# EAGLE design Adafruit Verter TPS63060 2A BoostBuck (EAGLE 6.3)
COMPANY: ADAFRUIT INDUSTRIES; DRAWN: KTOWN; REV: A
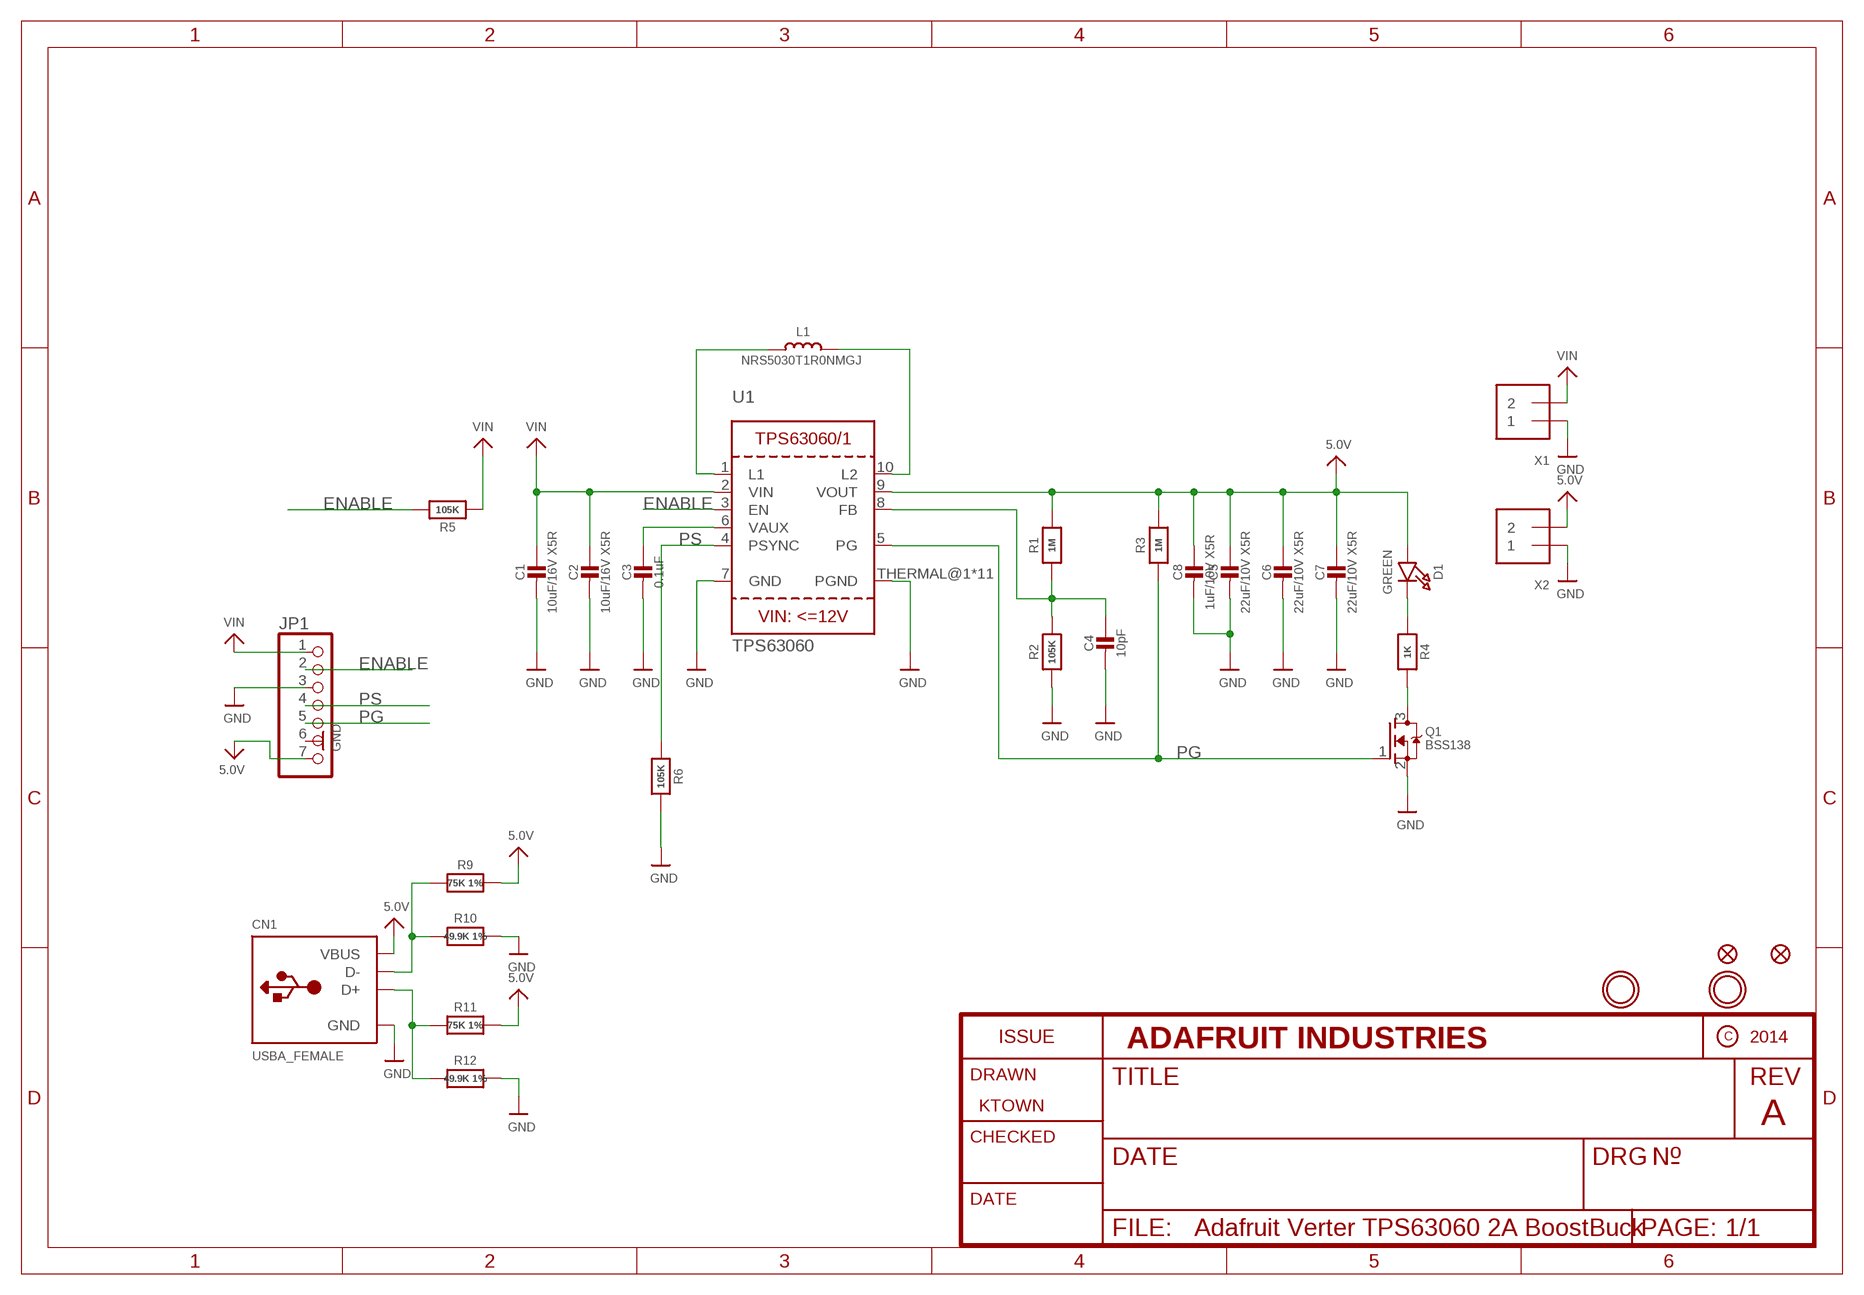
[diagram p0: schematic, sheet 1]

## Parts
C1  10uF/16V X5R  CAP_CERAMIC0805-NOOUTLINE  [0805-NO]
C2  10uF/16V X5R  CAP_CERAMIC0805-NOOUTLINE  [0805-NO]
C3  0.1uF  CAP_CERAMIC0805-NOOUTLINE  [0805-NO]
C4  10pF  CAP_CERAMIC0805-NOOUTLINE  [0805-NO]
C5  22uF/10V X5R  CAP_CERAMIC0805-NOOUTLINE  [0805-NO]
C6  22uF/10V X5R  CAP_CERAMIC0805-NOOUTLINE  [0805-NO]
C7  22uF/10V X5R  CAP_CERAMIC0805-NOOUTLINE  [0805-NO]
C8  1uF/10V X5R  CAP_CERAMIC0805-NOOUTLINE  [0805-NO]
CN1  USBA_FEMALE  USB_TYPEAPTHFML  [USB_HOST-PTH]
D1  GREEN  LED0805_NOOUTLINE  [CHIPLED_0805_NOOUTLINE]
FID1  FIDUCIAL""  [FIDUCIAL_1MM]
FID2  FIDUCIAL""  [FIDUCIAL_1MM]
JP1  HEADER-1X770MIL  [1X07_ROUND_70]
L1  NRS5030T1R0NMGJ  INDUCTORTDK_VLC5045  [INDUCTOR_5X5MM_TDK_VLC5045]
Q1  BSS138  MOSFET-NWIDE  [SOT23-WIDE]
R1  1M  RESISTOR0805_NOOUTLINE  [0805-NO]
R2  105K  RESISTOR0805_NOOUTLINE  [0805-NO]
R3  1M  RESISTOR0805_NOOUTLINE  [0805-NO]
R4  1K  RESISTOR0805_NOOUTLINE  [0805-NO]
R5  105K  RESISTOR0805_NOOUTLINE  [0805-NO]
R6  105K  RESISTOR0805_NOOUTLINE  [0805-NO]
R9  75K 1%  RESISTOR0805_NOOUTLINE  [0805-NO]
R10  49.9K 1%  RESISTOR0805_NOOUTLINE  [0805-NO]
R11  75K 1%  RESISTOR0805_NOOUTLINE  [0805-NO]
R12  49.9K 1%  RESISTOR0805_NOOUTLINE  [0805-NO]
U1  TPS63060  VREG_TPS63060/1  [PWSON-N10]
U$15  MOUNTINGHOLE2.5  [MOUNTINGHOLE_2.5_PLATED]
U$17  MOUNTINGHOLE2.5  [MOUNTINGHOLE_2.5_PLATED]
X1  TERMBLOCK_1X2  [TERMBLOCK_1X2-3.5MM]
X2  TERMBLOCK_1X2  [TERMBLOCK_1X2-3.5MM]

## Nets
5.0V: C5.1 C6.1 C7.1 C8.1 CN1.VBUS D1.A JP1.7 R1.2 R3.2 R9.2 R11.2 U1.9(VOUT) X2.2
D+: CN1.D+ R11.1 R12.1
D-: CN1.D- R9.1 R10.1
ENABLE: JP1.2 R5.2 U1.3(EN)
GND: C1.2 C2.2 C3.2 C4.2 C5.2 C6.2 C7.2 C8.2 CN1.GND JP1.3 JP1.6 Q1.2(S) R2.1 R6.2 R10.2 R12.2 U1.7(GND) U1.THERMAL@1(PGND) U1.THERMAL@5(PGND) U1.THERMAL@6(PGND) U1.THERMAL@7(PGND) U1.THERMAL@8(PGND) U1.THERMAL@9(PGND) U1.THERMAL@10(PGND) U1.THERMAL@11(PGND) U1.THERMAL@12(PGND) U1.THERMAL@13(PGND) U1.THERMAL@14(PGND) X1.1 X2.1
N$1: L1.P$1 U1.1(L1)
N$2: L1.P$2 U1.10(L2)
N$3: C3.1 U1.6(VAUX)
N$4: D1.C R4.1
N$5: C4.1 R1.1 R2.2 U1.8(FB)
N$6: Q1.3(D) R4.2
PG: JP1.5 Q1.1(G) R3.1 U1.5(PG)
PS: JP1.4 R6.1 U1.4(PSYNC)
VIN: C1.1 C2.1 JP1.1 R5.1 U1.2(VIN) X1.2

## Library data of the parts
C1-C8 = microbuilder:CAP_CERAMIC: Ceramic Capacitors For new designs, use the packages preceded by an '_' character since they are more reliable: The following footprints should be used on most boards: _0402 - Standard footprint for regular board layouts _0603 - Standard footprint for regular board layouts _0805 - Standard footprint for regular board layouts _1206 - Standard footprint for regular board layouts For extremely tight-pitch boards where space is at a premium, the following 'micro-pitch' footprints can be used (smaller pads, no silkscreen outline, etc.): _0402MP - Micro-pitch footprint for very dense/compact boards _0603MP - Micro-pitch footprint for very dense/compact boards _0805MP - Micro-pitch footprint for very dense/compact boards _1206MP - Micro-pitch footprint for very dense/compact boards
CN1 = microbuilder:USB_TYPEA: USB - Type A Connectors Male types stick out and are inserted into a PC or matching females parts (these are the connectors used on USB Memory Sticks, etc.). Female parts are generally used for USB Host and accept a male-type connector. SMT - 4UCON: 10017 PTHFML - Digikey: 609-1045-ND, 4UCon: 05241 PCB - Use 2.0mm thick PCBs with this footprint
D1 = microbuilder:LED: LED 0603 - 0603 Surface Mount Package 2mA: Green LED - Low Power (3.9mcd, 2ma, 1.7Vf) - Digikey: 475-2709-2-ND Orange LED - Low Power (9.8mcd, 2ma, 1.8Vf) - Digikey: 475-1194-2-ND Red LED - Low Power (5mcd, 2ma, 1.8Vf) - Digikey: 475-1195-2-ND Yellow LED - Low Power (7mcd, 2ma, 1.8Vf) - Digikey: 475-1196-2-ND 5mA: Blue LED - Low Power (17mcd, 5ma, 2.9Vf) - Digikey: LNJ937W8CRACT-ND 0805 - 0805 Surface Mount Package 2mA: Red LED (8.8mcd, 2mA, 1.8Vf, Clear) - Low Power [Digikey: 475-2510-1-ND] Green LED (5mcd, 2mA, 1.8Vf, Clear) - Low Power [Digikey: 475-2730-1-ND] Yellow LED (11.3mcd, 2mA, 1.8Vf, Clear) - Low Power [Digikey: 475-2555-1-ND] 20mA: Red LED (104mcd, 20mA, Diffused) - LS R976 [Digikey: 475-1278-6-ND] Red LED (12mcd, 20mA, 2.0Vf, Clear) - APT2012EC [Digikey: 754-1128-1-ND] Green LED (15mcd, 20mA, 2.2Vf, Clear) - APT2012GC [Digikey: 754-1131-1-ND] Orange LED (160mcd, 20mA, 2.1Vf, Clear) - APT2012SECK [Digikey: 754-1130-1-ND] 1206 - 1206 Surface Mount Package Green LED (26mcd, 20mA, Diffused) - LG N971 [Digikey: 475-1407-6-ND] Red LED (15mcd, 20mA, Diffused) - LH N974 [Digikey: 475-1416-6-ND] Cree - Cree High-Power Surface Mount LEDs XPEBWT-L1-0000-00D50 - White 111lm 350mA 2.9Vf 6200K 110° XTEAWT-00-0000-00000LEE3 - White 114lm 350mA 2.85Vf 5000K 115° Everlight - Everlight 45-21 Series Surface Mount LEDs 45-21/QK2C-B2832AC2CB2/2T - Warm White 2000mcd 20mA 3.25Vf 3050K 120° 45-21/LK2C-B38452C4CB2/2T - Nuetral White 2000mcd 20mA 3.25Vf 4150K 120° 45-21/LK2C-B50634C6CB2/2T - Cold White 2200mcd 20mA 3.25Vf 5650K 120° PLCC2 Reverse Mount LS T77K-J1L2-1-0-2-R18-Z - Red 11.25mcd 2mA 1.8Vf 630nm 120° LO T77K-L1M2-24-Z - Orange 19.6mcd 2mA 1.8Vf 606nm 120° LY T77K-K2M1-26-Z - Yellow 15.7mcd 2mA 1.8Vf 587nm 120°
FID1 FID2 = microbuilder:FIDUCIAL: Fiducial Alignment Points Various fiducial points for machine vision alignment.; BOM: EXCLUDE
JP1 = microbuilder:HEADER-1X7: PIN HEADER
L1 = microbuilder:INDUCTOR: Inductors 0603: 10nH Ceramic Inductor - microwire antenna/RF (Digikey: 712-1434-2-ND) 0805: 560nH Ceramic Inductor - RF (Digikey: 553-1047-1-ND) 270nH Ceramic Inductor - Q = 40@250MHz, +-5%, 1 Ohm DC Resistance (Digikey: 535-10506-2-ND) 1007 (2518 Metric) SMT: 10µH 10% 250mOhm 820mA 1007 Inductor (Digikey: 587-2189-1-ND) 22µH 10% 500mOhm 580mA 1007 Inductor (Digikey: 587-2190-1-ND) 47µH 10% 950mOhm 420mA 1007 Inductor (Digikey: 587-2191-1-ND) 47µH 5% 100mOhm 1A 1008 Inductor (Digikey: 732-1816-1-ND) 5.0x5.0mm (Taiyo Yuden NR5040 Series) 6.8µH 20% 2.3A 64mOhm Inductor (Digikey: 587-2374-2-ND) 5.0x5.0mm (TDK VLC5045 Series) 4.7µH 20% 3.3A 34mOhm Inductor (Digikey: 445-6526-1-ND) 6.8µH 20% 2.7A 46mOhm Inductor (Digikey: 445-6527-1-ND) 6.0x6.0mm (TDK VLC6045 Series) 4.7µH 20% 3.8A 27mOhm Inductor (Digikey: 445-6538-2-ND) 6.8µH 20% 3A 41mOhm Inductor (Digikey: 445-6540-1-ND) 6.2µH 30% 2.2A 45mOhm Inductor (Digikey: SRR5028-6R2YCT-ND) - Not TDK VLC6045 but footprint should match 6.0x6.0mm (TDK SLF6045 Series) 6.8uH 30% 2A 33mOhm Inductor (Digikey: 445-4572-1-ND, Mouser: 810-SLF645T6R8N2R0PF) 6.0x6.0mm (Sumida CDRH5D28 Series) 6.2uH 30% 1.8A 45mOhm Inductor (Digikey: 308-1542-1-ND) Taiyo Yuden NR3015T2R2M - 2.2uH 20% 1.5A (Digikey: 587-1648-2-ND, Mouser: 963-NR3015T2R2M) - Used with TI TPS62172 CoilCraft RFID Transponder Coil - MA5532-AE (For use with AS3935 Lightning Sensor) Vishay IHLP 1.0uH Molded Inductor - 24mOhm DCR, 5A, +/-20%, -55°C-125°C (Digikey: 541-1319-1-ND)
Q1 = microbuilder:MOSFET-N: N-Channel Mosfet LEGEND VDS: Voltage Drain-Source ID: Drain Current RDS(ON): Drain-Source On-State Resistance VGS(TH): Gate-Source Threshold Voltage CISS: Drain-Source Input Capacitance SOT-23 Name VDS ID RDS(ON) VGS(TH) CISS Order Number 2N7002E 60V 260mA 2.5 Ohm 2.5V @ 250uA 26.7pF @ 25V 2N7002ET1GOSTR-ND BSH103 30V 850mA 400 mOhm 400mV @ 1mA 83pF @ 24V BSH103,235-ND BSS138 60V 320mA 1.6 Ohm 1.5V @ 250uA 50pF @ 10V Mouser: 771-BSS138PW115 DMN2075U-7 20V 4.2A 38 mOhm 1V @ 250 uA 594.3pF @ 10V DMN2075U-7DICT-ND * BSS138 good choice for I2C level-shifting POWERPAK 1212-8 Name VDS ID RDS(ON) VGS(TH) CISS Order Number Si7308DN 60V 6A 58 mOhm 3V @ 250uA 665pF @ 15V SI7308DN-T1-E3CT-ND
R1-R6 R9-R12 = microbuilder:RESISTOR: Resistors For new designs, use the packages preceded by an '_' character since they are more reliable: The following footprints should be used on most boards: _0402 - Standard footprint for regular board layouts _0603 - Standard footprint for regular board layouts _0805 - Standard footprint for regular board layouts _1206 - Standard footprint for regular board layouts For extremely tight-pitch boards where space is at a premium, the following 'micro-pitch' footprints can be used (smaller pads, no silkscreen outline, etc.): _0402MP - Micro-pitch footprint for very dense/compact boards _0603MP - Micro-pitch footprint for very dense/compact boards _0805MP - Micro-pitch footprint for very dense/compact boards _1206MP - Micro-pitch footprint for very dense/compact boards
U1 = microbuilder:VREG_TPS63060/1: TPS63060/63061 2A Boost/Buck Switch Converter VIN: 2.5 - 12V Fixed frequency operation: 2.4MHz
U$15 U$17 = microbuilder:MOUNTINGHOLE: Mounting Hole For #2 screws (0.086"/2.18mm width, 0.094"/2.4mm hole) use 2.5mm; BOM: EXCLUDE
X1 X2 = microbuilder:TERMBLOCK_1X2: 3.5mm Terminal block http://www.ladyada.net/library/pcb/eaglelibrary.html

## Board
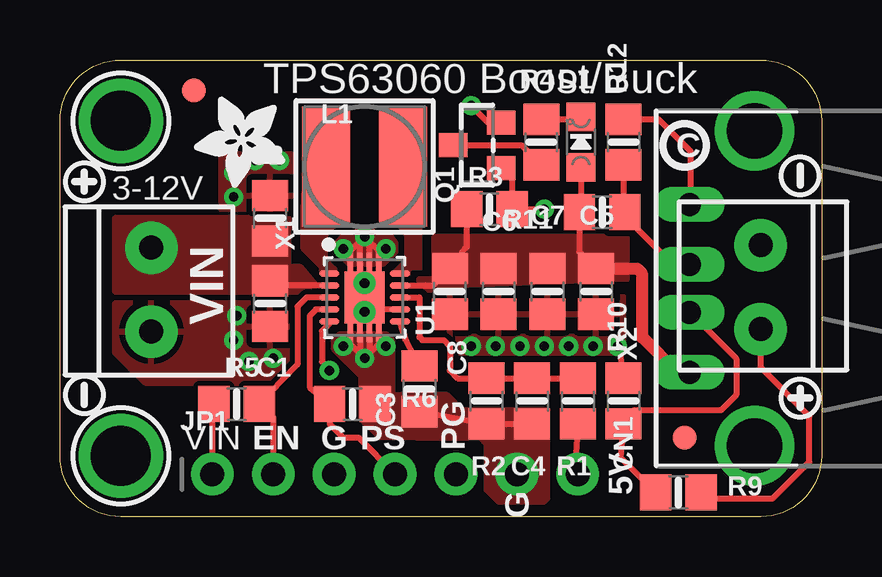
[diagram p1: board, top side]
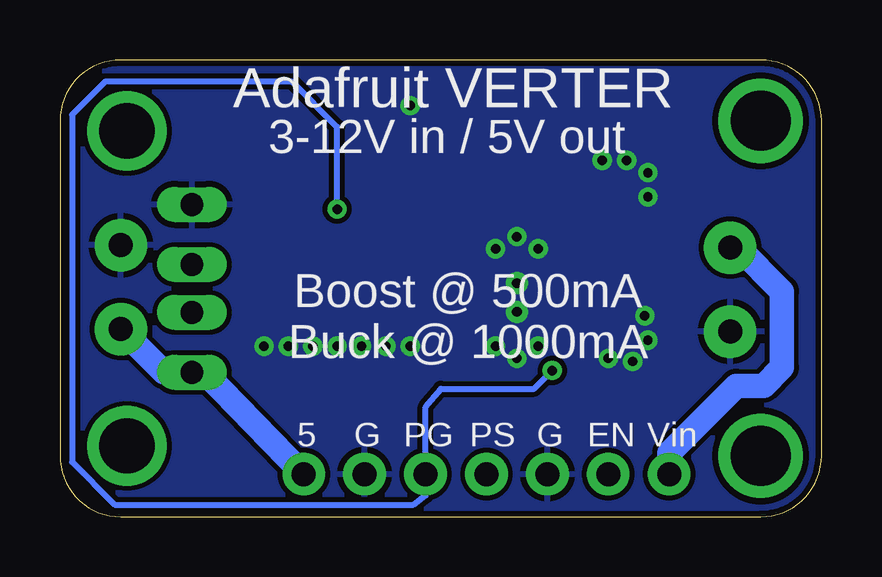
[diagram p2: board, bottom side, seen from below]

Size 31.75 x 19.05 mm. Coordinates in mm from the lower left corner, seen from the top.
Outline: 31.75,16.51 31.75,2.54 arc-90 29.21,0 2.54,0 arc-90 0,2.54 0,16.51 arc-90 2.54,19.05 29.21,19.05 arc-90 31.75,16.51
Copper layers (1*16): Top 0.035mm / dielectric 1.5mm / Bottom 0.035mm
Design rules "adafruit": minimum track width 8mil, minimum drill 15.5mil, track to track 8mil, track to pad 8mil, pad to pad 8mil, via to via 8mil, smd to smd 8mil, copper to edge 10mil, drill to drill 8mil, minimum pad ring 10mil, minimum via ring 8mil, stop-mask expansion 2mil, vias tented up to drill 20mil, thermal gap 10mil

### Footprints (pad centres in the part's own frame; a part is rotated, then mirrored left to right if it is on the bottom)
0805-NO = smd 1.3 x 1.5: 1 -0.95,0; 2 0.95,0
USB_HOST-PTH = drill 0.95 long: D+ 1,6.52; D- -1,6.52; GND 3.5,6.52; VBUS -3.5,6.52 | drill 2.3 pad 2.9: S1 -6.57,3.81; S2 6.57,3.81
CHIPLED_0805_NOOUTLINE = smd 1.2 x 1.2: A 0,-1.05; C 0,1.05
FIDUCIAL_1MM = smd 1 x 1: 1 0,0
1X07_ROUND_70 = drill 1 pad 1.778: 1 -7.62,0; 2 -5.08,0; 3 -2.54,0; 4 0,0; 5 2.54,0; 6 5.08,0; 7 7.62,0
INDUCTOR_5X5MM_TDK_VLC5045 = smd 2 x 5: P$1 -1.6,0; P$2 1.6,0
SOT23-WIDE = smd 1 x 1.2: 1 -0.95,-1; 2 0.95,-1; 3 0,1
PWSON-N10 = smd 0.28 x 0.85: 1 -1,-1.475; 2 -0.5,-1.475; 3 0,-1.475; 4 0.5,-1.475; 5 1,-1.475; 6 1,1.475; 7 0.5,1.475; 8 0,1.475; 9 -0.5,1.475; 10 -1,1.475 | smd 2.15 x 1.66: THERMAL@1 0,0 | drill 0.4 pad 0.6: THERMAL@5 -0.6,0; THERMAL@6 0.6,0 | smd 0.8 x 0.23: THERMAL@7 1.46,0.6; THERMAL@8 1.46,0.2; THERMAL@9 1.46,-0.2; THERMAL@10 1.46,-0.6; THERMAL@11 -1.46,-0.6; THERMAL@12 -1.46,-0.2; THERMAL@13 -1.46,0.2; THERMAL@14 -1.46,0.6
MOUNTINGHOLE_2.5_PLATED = drill 2.5 pad 3.2: P$1 0,0
TERMBLOCK_1X2-3.5MM = drill 1 pad 2.184: 1 1.8,0; 2 -1.7,0

### Placement (x,y rotation side)
C1  8.76,8.89 270 top
C2  8.76,12.45 90 top
C3  14.99,5.33 270 top
C4  19.68,4.83 270 top
C5  22.35,9.4 270 top
C6  18.29,9.4 270 top
C7  20.32,9.4 270 top
C8  16.26,9.4 270 top
CN1  32.77,9.53 90 top
D1  21.72,15.62 0 top
FID1  26.04,3.3 0 top
FID2  5.59,17.78 0 top
JP1  13.97,1.78 0 top
L1  12.7,14.61 0 top
Q1  17.4,15.49 90 top
R1  21.59,4.83 270 top
R2  17.78,4.83 90 top
R3  17.91,12.83 180 top
R4  20.07,15.62 270 top
R5  7.37,4.7 0 top
R6  12.19,4.7 0 top
R9  25.78,1.02 0 top
R10  23.5,4.83 90 top
R11  22.61,12.7 180 top
R12  23.5,15.62 90 top
U1  12.7,9.14 270 top
U$15  2.54,2.54 0 top
U$17  2.54,16.51 0 top
U$22  [SYMBOL_PLUS]  30.86,4.95 90 top
U$23  [SYMBOL_PLUS]  1.02,13.97 90 top
U$24  [SYMBOL_MINUS]  30.86,14.22 90 top
U$25  [SYMBOL_MINUS]  1.02,5.08 90 top
U$27  [ADAFRUIT_3.5MM]  9.4,17.53 180 top
U$37  [VERTERLOGO]  24.51,10.54 0 bottom
U$38  [PCBFEAT-REV-040]  26.04,15.49 0 top
X1  3.81,9.53 270 top
X2  29.21,9.53 90 top

### Tracks (layer width: path | path; a pad name or v marks a point on that pad's centre or on a via)
5.0V
  Top 0.254: U1.9 15.23,9.64 15.24,9.65 15.56,9.65 C8.1 16.76,10.86 16.76,11.05 16.96,11.24 R3.2 | C5.1 21.66,11.04 R11.2 21.72,12.76 D1.A | R9.2 26.48,0.76 29.72,0.76 31.24,2.29 31.24,4.19 29.21,6.22 X2.2 | R1.2 21.46,2.03 JP1.7
  Top 0.508: C5.1 24.07,10.35 24.26,10.16 24.26,7.49 25.73,6.03 CN1.VBUS
  Bottom 1.016: X2.2 27.41,6.03 CN1.VBUS 25.71,6.03 JP1.7
  pour Top (isolate 0.254, rank 2, no thermals): 14.99,9.91 15.62,9.91 15.62,11.68 23.62,11.68 23.62,9.91 16.51,9.65 16.26,9.65 16.26,9.4 14.99,9.4
D+
  Top 0.254: CN1.D+ 26.23,10.54 25.53,10.54 23.56,12.51 R11.1 23.5,12.76 R12.1
D-
  Top 0.254: CN1.D- 26.27,8.53 28.19,6.6 28.19,5.08 27.56,4.45 23.94,4.45 R10.1 23.37,2.48 R9.1
ENABLE
  Top 0.254: U1.3 10.29,9.14 9.91,8.76 9.91,6.35 9.27,5.71 R5.2 8.89,4.12 JP1.2
GND  (via drill 0.39)
  Top 0.254: U1.7 12.7,8.64 U1.THERMAL@6 12.9,8.34 U1.THERMAL@8 12.9,6.8 v12.7,6.6 | v12.7,11.68 12.5,11.48 U1.THERMAL@12 12.5,9.94 U1.THERMAL@5 U1.THERMAL@1 | U1.THERMAL@13 12.9,11.48 v12.7,11.68 | U1.THERMAL@14 13.3,11.08 v12.7,11.68 | U1.THERMAL@11 12.1,11.08 v12.7,11.68 | U1.THERMAL@9 12.5,6.8 v12.7,6.6 | U1.THERMAL@10 12.1,7.2 v12.7,6.6 | U1.THERMAL@7 13.3,7.2 v12.7,6.6 | C3.2 R2.1 C4.2 | R10.2 23.37,6.86 v23.24,7.11 | R12.2 24.96,16.57 26.29,15.24 26.29,13.07 CN1.GND | Q1.2 17.85,16.44 v17.14,17.14
  Bottom 0.254: v17.14,17.14 16.76,17.14
  other vias: 7.24,7.37 7.37,8.38 7.87,6.48 8.89,6.6 17.14,7.11 19.18,7.11 21.21,7.11 11.81,7.11 13.59,7.11 11.81,11.18 13.59,11.18 9.14,14.86 8.13,14.86 7.24,14.35 7.24,13.34 18.16,7.11 20.19,7.11 22.23,7.11
  pour Top: 2.29,8.89 2.29,6.86 3.56,5.59 10.41,5.59 10.41,8.89
  pour Top: 15.75,9.14 15.75,6.86 23.5,6.86 23.5,9.14
  pour Bottom: 0,19.05 0,0 32.13,0 32.13,19.05
  pour Top (rank 2): 11.56,11.43 12.06,11.94 13.59,11.94 13.97,11.43 13.97,11.05 13.46,10.54 12.06,10.54 11.56,11.05
  pour Top (no thermals): 11.68,7.62 13.59,7.62 13.84,7.37 13.84,5.08 16,5.08 16,3.3 13.34,3.3 12.57,4.06 12.57,5.84 11.43,6.99 11.43,7.37
  pour Top: 9.65,12.83 6.73,12.83 6.73,14.99 6.86,15.11 9.65,15.11
  pour Top (no thermals): 14.22,5.08 14.22,3.94 14.61,3.56 14.86,3.3 17.53,3.3 17.78,3.05 17.78,1.14 18.29,0.64 20.19,0.64 20.32,0.76 20.32,4.45 16.76,4.45 16.13,5.08
N$1
  pour Top (isolate 0.254, rank 4, no thermals): 11.43,10.16 10.92,10.16 10.92,10.41 10.16,11.18 10.16,13.46 11.94,13.46 11.94,12.19 11.43,11.68
N$2
  pour Top (isolate 0.254, rank 4, no thermals): 13.97,10.16 14.99,10.16 14.99,13.46 13.46,13.46 13.46,12.19 13.97,11.68
N$3
  Top 0.254: C3.1 14.43,7.35 U1.6
N$4
  Top 0.254: R4.1 21.62,16.57 D1.C
N$5
  Top 0.254: U1.8 14.99,9.14 14.99,7.49 15.11,7.37 16,7.37 16.26,7.11 16.26,6.1 16.58,5.78 R2.2 C4.1 R1.1
N$6
  Top 0.254: Q1.3 19.24,15.49 R4.2
PG  (via drill 0.39)
  Top 0.254: U1.5 11.22,8.05 10.92,7.75 10.92,6.48 11.05,6.35 v11.22,6.1 | Q1.1 18.86,14.09 R3.1 v20.19,12.83
  Bottom 0.254: v20.19,12.83 20.19,16.26 22.1,18.16 29.84,18.16 31.24,16.76 31.24,2.29 29.46,0.51 17.02,0.51 16.51,0.89 JP1.5 16.51,4.57 15.88,5.33 11.99,5.33 v11.22,6.1
PS
  Top 0.254: JP1.4 12.45,3.3 11.81,3.3 11.24,3.87 R6.1 10.41,5.4 10.41,8.38 10.68,8.64 U1.4
VIN
  Top 0.254: U1.2 9.14,9.64 C1.1 | R5.1 6.35,4.63 JP1.1
  Bottom 1.016: JP1.1 6.35,2.67 3.56,5.46 2.41,5.46 1.65,6.22 1.65,9.4 3.48,11.22 X1.2
  pour Top (no thermals): 2.29,12.45 2.29,9.4 10.41,9.4 10.41,9.65 10.67,9.65 10.03,10.41 9.53,10.41 9.53,12.45

### Text on the board
tPlace: TPS63060 Boost/Buck | 3-12V | VIN | PG | VIN | EN | G | PS | 5V | G
bPlace: Adafruit VERTER | 3-12V in / 5V out | Boost @ 500mA / Buck @ 1000mA | Vin | EN | G | PS | PG | G | 5